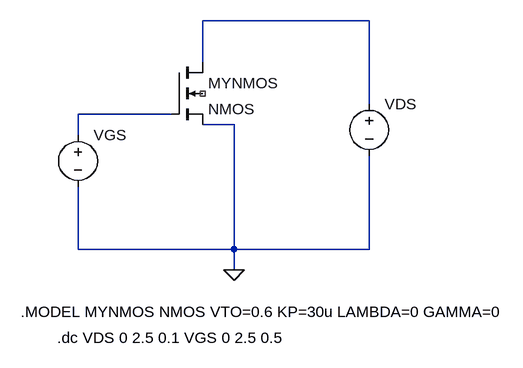
[diagram p0: schematic Prelab 6 Part 1.asc]
Prelab 6 Part 1.asc, the LTspice schematic file:
Version 4
SHEET 1 880 680
WIRE 480 -16 224 -16
WIRE 224 48 224 -16
WIRE 480 112 480 -16
WIRE 176 128 32 128
WIRE 272 144 224 144
WIRE 32 160 32 128
WIRE 32 336 32 240
WIRE 272 336 272 144
WIRE 272 336 32 336
WIRE 480 336 480 192
WIRE 480 336 272 336
WIRE 272 368 272 336
FLAG 272 368 0
SYMBOL voltage 32 144 R0
SYMATTR InstName VGS
SYMATTR Value ""
SYMBOL nmos4 176 48 R0
SYMATTR InstName MYNMOS
SYMBOL voltage 480 96 R0
SYMATTR InstName VDS
SYMATTR Value ""
TEXT -56 432 Left 2 !.MODEL MYNMOS NMOS VTO=0.6 KP=30u LAMBDA=0 GAMMA=0
TEXT 0 472 Left 2 !.dc VDS 0 2.5 0.1 VGS 0 2.5 0.5

The netlist it stands for:
* Prelab 6 Part 1.asc
VGS N002 0
MYNMOS N001 N002 0 NC_01 NMOS
VDS N001 0
.model NMOS NMOS
.model PMOS PMOS
.lib standard.mos
.MODEL MYNMOS NMOS VTO=0.6 KP=30u LAMBDA=0 GAMMA=0
.dc VDS 0 2.5 0.1 VGS 0 2.5 0.5
.backanno
.end